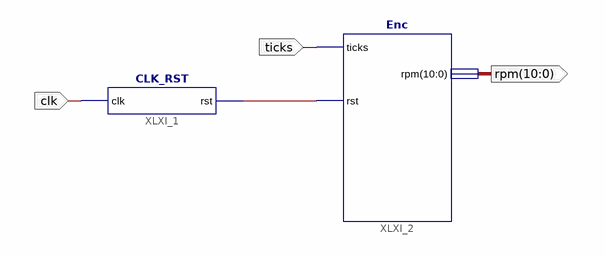
[diagram p0: schematic sheet 1]
// Xilinx ISE schematic Enc_Circiut.sch (spartan3e) as structural Verilog: 2 symbols, 3 ports
module Enc_Circiut (
  input  ticks,
  input  clk,
  output [10:0] rpm
);

  wire XLXN_1;

  CLK_RST XLXI_1 (.clk(clk), .rst(XLXN_1));
  Enc XLXI_2 (.ticks(ticks), .rst(XLXN_1), .rpm(rpm));
endmodule
